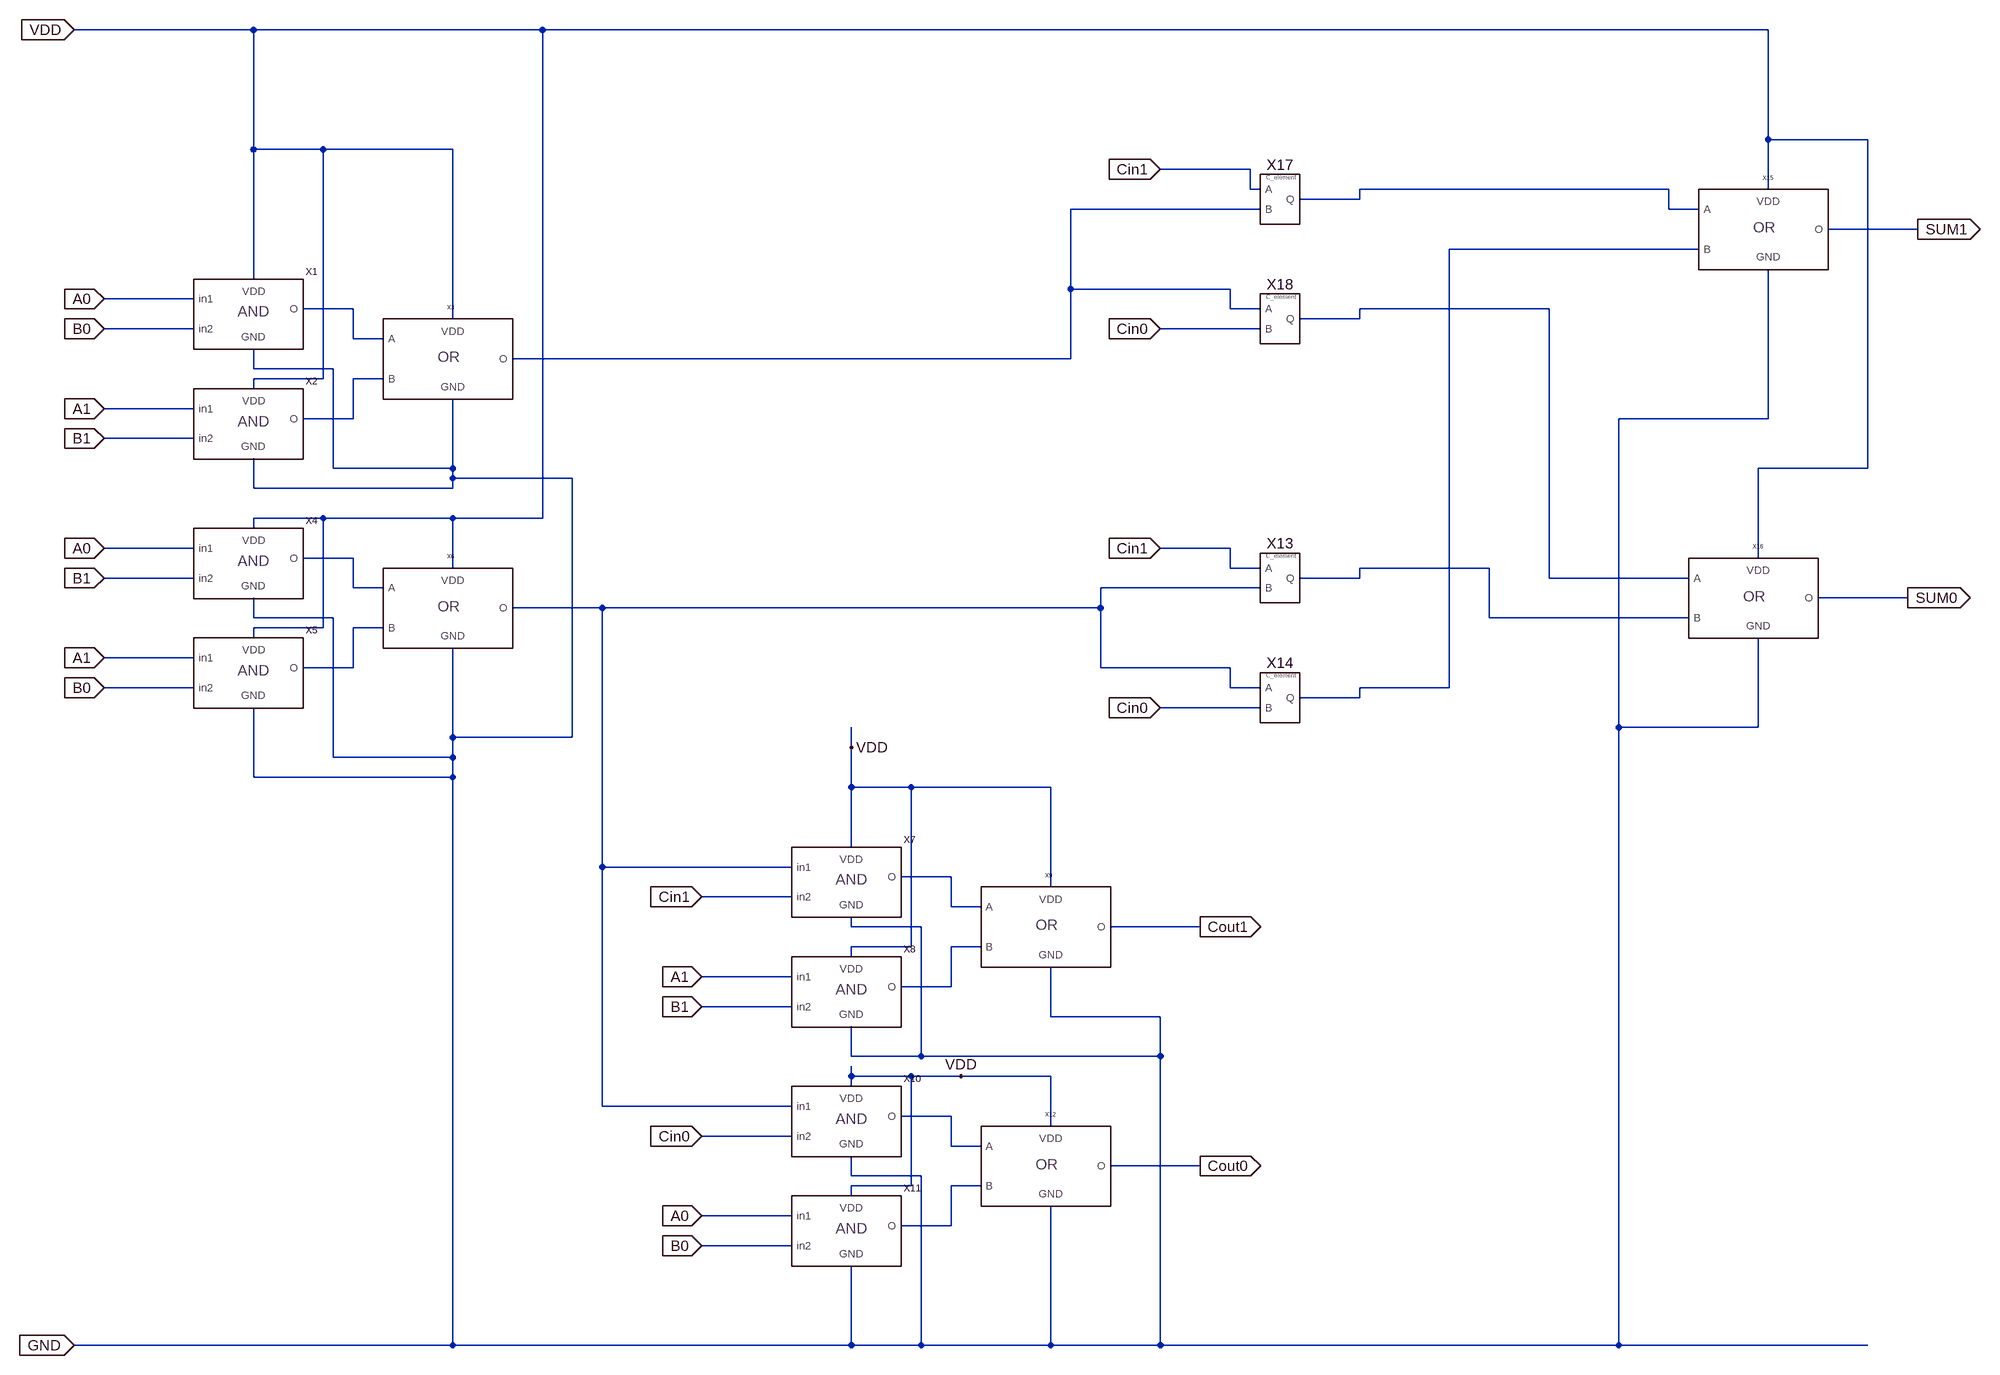
[diagram p0: schematic EFA.asc]
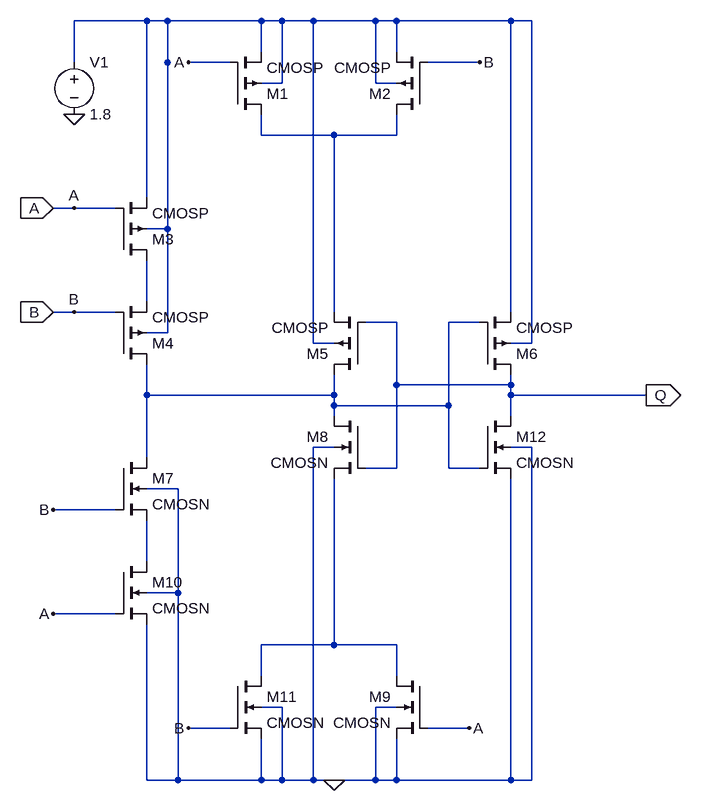
[diagram p1: sub-circuit muller_c_sutherland.asc]
EFA.asc, the LTspice schematic file:
Version 4
SHEET 1 2688 1640
WIRE -112 -544 -400 -544
WIRE 352 -544 -112 -544
WIRE 2320 -544 352 -544
WIRE 2320 -368 2320 -544
WIRE 2480 -368 2320 -368
WIRE -112 -352 -112 -544
WIRE 0 -352 -112 -352
WIRE 208 -352 0 -352
WIRE 1488 -320 1344 -320
WIRE 1488 -288 1488 -320
WIRE 1504 -288 1488 -288
WIRE 2160 -288 1664 -288
WIRE 2320 -288 2320 -368
WIRE 1664 -272 1664 -288
WIRE 1664 -272 1568 -272
WIRE 1504 -256 1200 -256
WIRE 2160 -256 2160 -288
WIRE 2208 -256 2160 -256
WIRE 2560 -224 2416 -224
WIRE 2208 -192 1808 -192
WIRE -112 -144 -112 -352
WIRE 1200 -128 1200 -256
WIRE 1456 -128 1200 -128
WIRE -208 -112 -352 -112
WIRE 48 -96 -32 -96
WIRE 1456 -96 1456 -128
WIRE 1504 -96 1456 -96
WIRE 1968 -96 1664 -96
WIRE 208 -80 208 -352
WIRE 1664 -80 1664 -96
WIRE 1664 -80 1568 -80
WIRE -208 -64 -352 -64
WIRE 1504 -64 1344 -64
WIRE 48 -48 48 -96
WIRE 96 -48 48 -48
WIRE 1200 -16 1200 -128
WIRE 1200 -16 304 -16
WIRE -112 0 -112 -32
WIRE 16 0 -112 0
WIRE 0 16 0 -352
WIRE 0 16 -112 16
WIRE 96 16 48 16
WIRE -112 32 -112 16
WIRE -208 64 -352 64
WIRE 48 80 48 16
WIRE 48 80 -32 80
WIRE 2320 80 2320 -160
WIRE 2320 80 2080 80
WIRE -208 112 -352 112
WIRE 16 160 16 0
WIRE 208 160 208 48
WIRE 208 160 16 160
WIRE 2480 160 2480 -368
WIRE 2480 160 2304 160
WIRE 208 176 208 160
WIRE 400 176 208 176
WIRE -112 192 -112 144
WIRE 208 192 208 176
WIRE 208 192 -112 192
WIRE 0 240 -112 240
WIRE 208 240 0 240
WIRE 352 240 352 -544
WIRE 352 240 208 240
WIRE -112 256 -112 240
WIRE -208 288 -352 288
WIRE 1456 288 1344 288
WIRE 48 304 -32 304
WIRE 2304 304 2304 160
WIRE 208 320 208 240
WIRE 1456 320 1456 288
WIRE 1504 320 1456 320
WIRE 1872 320 1664 320
WIRE -208 336 -352 336
WIRE 1664 336 1664 320
WIRE 1664 336 1568 336
WIRE 1968 336 1968 -96
WIRE 2192 336 1968 336
WIRE 48 352 48 304
WIRE 96 352 48 352
WIRE 1504 352 1248 352
WIRE 2544 368 2400 368
WIRE 448 384 304 384
WIRE 1248 384 1248 352
WIRE 1248 384 448 384
WIRE -112 400 -112 368
WIRE 16 400 -112 400
WIRE 1872 400 1872 320
WIRE 2192 400 1872 400
WIRE 0 416 0 240
WIRE 0 416 -112 416
WIRE 96 416 48 416
WIRE -112 432 -112 416
WIRE -208 464 -352 464
WIRE 48 480 48 416
WIRE 48 480 -32 480
WIRE 1248 480 1248 384
WIRE 1456 480 1248 480
WIRE -208 512 -352 512
WIRE 1456 512 1456 480
WIRE 1504 512 1456 512
WIRE 1808 512 1808 -192
WIRE 1808 512 1664 512
WIRE 1664 528 1664 512
WIRE 1664 528 1568 528
WIRE 1504 544 1344 544
WIRE 2080 576 2080 80
WIRE 2304 576 2304 432
WIRE 2304 576 2080 576
WIRE 208 592 208 448
WIRE 400 592 400 176
WIRE 400 592 208 592
WIRE 848 608 848 576
WIRE 16 624 16 400
WIRE 208 624 208 592
WIRE 208 624 16 624
WIRE -112 656 -112 544
WIRE 208 656 208 624
WIRE 208 656 -112 656
WIRE 848 672 848 608
WIRE 944 672 848 672
WIRE 1168 672 944 672
WIRE 848 768 848 672
WIRE 448 800 448 384
WIRE 752 800 448 800
WIRE 1008 816 928 816
WIRE 1168 832 1168 672
WIRE 752 848 608 848
WIRE 1008 864 1008 816
WIRE 1056 864 1008 864
WIRE 848 896 848 880
WIRE 960 896 848 896
WIRE 1408 896 1264 896
WIRE 944 928 944 672
WIRE 944 928 848 928
WIRE 1056 928 1008 928
WIRE 848 944 848 928
WIRE 752 976 608 976
WIRE 1008 992 1008 928
WIRE 1008 992 928 992
WIRE 752 1024 608 1024
WIRE 1168 1040 1168 960
WIRE 1344 1040 1168 1040
WIRE 848 1104 848 1056
WIRE 960 1104 960 896
WIRE 960 1104 848 1104
WIRE 1344 1104 1344 1040
WIRE 1344 1104 960 1104
WIRE 848 1136 848 1120
WIRE 944 1136 848 1136
WIRE 1024 1136 944 1136
WIRE 1168 1136 1024 1136
WIRE 848 1152 848 1136
WIRE 448 1184 448 800
WIRE 752 1184 448 1184
WIRE 1008 1200 928 1200
WIRE 1168 1216 1168 1136
WIRE 752 1232 608 1232
WIRE 1008 1248 1008 1200
WIRE 1056 1248 1008 1248
WIRE 1408 1280 1264 1280
WIRE 848 1296 848 1264
WIRE 960 1296 848 1296
WIRE 944 1312 944 1136
WIRE 944 1312 848 1312
WIRE 1056 1312 1008 1312
WIRE 848 1328 848 1312
WIRE 752 1360 608 1360
WIRE 1008 1376 1008 1312
WIRE 1008 1376 928 1376
WIRE 752 1408 608 1408
WIRE 208 1568 208 656
WIRE 208 1568 -400 1568
WIRE 848 1568 848 1440
WIRE 848 1568 208 1568
WIRE 960 1568 960 1296
WIRE 960 1568 848 1568
WIRE 1168 1568 1168 1344
WIRE 1168 1568 960 1568
WIRE 1344 1568 1344 1104
WIRE 1344 1568 1168 1568
WIRE 2080 1568 2080 576
WIRE 2080 1568 1344 1568
WIRE 2480 1568 2080 1568
FLAG -352 -112 A0
IOPIN -352 -112 In
FLAG -352 64 A1
IOPIN -352 64 In
FLAG -352 112 B1
IOPIN -352 112 In
FLAG -352 -64 B0
IOPIN -352 -64 In
FLAG -352 288 A0
IOPIN -352 288 In
FLAG -352 464 A1
IOPIN -352 464 In
FLAG -352 512 B0
IOPIN -352 512 In
FLAG -352 336 B1
IOPIN -352 336 In
FLAG 608 976 A1
IOPIN 608 976 In
FLAG 608 1024 B1
IOPIN 608 1024 In
FLAG 608 848 Cin1
IOPIN 608 848 In
FLAG 608 1360 A0
IOPIN 608 1360 In
FLAG 608 1408 B0
IOPIN 608 1408 In
FLAG 608 1232 Cin0
IOPIN 608 1232 In
FLAG 1344 -320 Cin1
IOPIN 1344 -320 In
FLAG 1344 288 Cin1
IOPIN 1344 288 In
FLAG 1344 544 Cin0
IOPIN 1344 544 In
FLAG 1344 -64 Cin0
IOPIN 1344 -64 In
FLAG 2560 -224 SUM1
IOPIN 2560 -224 Out
FLAG 2544 368 SUM0
IOPIN 2544 368 Out
FLAG 1408 896 Cout1
IOPIN 1408 896 Out
FLAG 1408 1280 Cout0
IOPIN 1408 1280 Out
FLAG -400 -544 VDD
IOPIN -400 -544 In
FLAG 848 608 VDD
FLAG 1024 1136 VDD
FLAG -400 1568 GND
IOPIN -400 1568 In
SYMBOL AND -144 -96 R0
SYMATTR InstName X1
SYMBOL AND -144 80 R0
SYMATTR InstName X2
SYMBOL or 192 -16 R0
SYMATTR InstName X3
SYMBOL AND -144 304 R0
SYMATTR InstName X4
SYMBOL AND -144 480 R0
SYMATTR InstName X5
SYMBOL or 192 384 R0
SYMATTR InstName X6
SYMBOL AND 816 816 R0
SYMATTR InstName X7
SYMBOL AND 816 992 R0
SYMATTR InstName X8
SYMBOL or 1152 896 R0
SYMATTR InstName X9
SYMBOL AND 816 1200 R0
SYMATTR InstName X10
SYMBOL AND 816 1376 R0
SYMATTR InstName X11
SYMBOL or 1152 1280 R0
SYMATTR InstName X12
SYMBOL Muller_c_sutherland 1536 336 R0
SYMATTR InstName X13
SYMBOL Muller_c_sutherland 1536 528 R0
SYMATTR InstName X14
SYMBOL or 2304 -224 R0
SYMATTR InstName X15
SYMBOL or 2288 368 R0
SYMATTR InstName X16
SYMBOL Muller_c_sutherland 1536 -272 R0
SYMATTR InstName X17
SYMBOL Muller_c_sutherland 1536 -80 R0
SYMATTR InstName X18

muller_c_sutherland.asc, the sub-circuit schematic file:
Version 4
SHEET 1 880 1236
WIRE -32 -64 -144 -64
WIRE 0 -64 -32 -64
WIRE 144 -64 0 -64
WIRE 176 -64 144 -64
WIRE 224 -64 176 -64
WIRE 320 -64 224 -64
WIRE 352 -64 320 -64
WIRE 528 -64 352 -64
WIRE 560 -64 528 -64
WIRE 144 -16 144 -64
WIRE 352 -16 352 -64
WIRE -144 0 -144 -64
WIRE 96 0 32 0
WIRE 480 0 400 0
WIRE 176 32 176 -64
WIRE 176 32 144 32
WIRE 320 32 320 -64
WIRE 352 32 320 32
WIRE 144 112 144 80
WIRE 256 112 144 112
WIRE 352 112 352 80
WIRE 352 112 256 112
WIRE -32 208 -32 -64
WIRE -144 224 -176 224
WIRE -80 224 -144 224
WIRE 0 256 0 -64
WIRE 0 256 -32 256
WIRE -32 368 -32 304
WIRE -144 384 -176 384
WIRE -80 384 -144 384
WIRE 256 384 256 112
WIRE 528 384 528 -64
WIRE 352 400 304 400
WIRE 480 400 432 400
WIRE 0 416 0 256
WIRE 0 416 -32 416
WIRE 224 432 224 -64
WIRE 256 432 224 432
WIRE 560 432 560 -64
WIRE 560 432 528 432
WIRE 352 496 352 400
WIRE 528 496 528 480
WIRE 528 496 352 496
WIRE -32 512 -32 464
WIRE 256 512 256 480
WIRE 256 512 -32 512
WIRE 528 512 528 496
WIRE 736 512 528 512
WIRE 256 528 256 512
WIRE 432 528 432 400
WIRE 432 528 256 528
WIRE 256 544 256 528
WIRE 528 544 528 512
WIRE 256 592 224 592
WIRE 560 592 528 592
WIRE -32 608 -32 512
WIRE 352 624 352 496
WIRE 352 624 304 624
WIRE 432 624 432 528
WIRE 480 624 432 624
WIRE 16 656 -32 656
WIRE -80 688 -176 688
WIRE -32 768 -32 704
WIRE 16 816 16 656
WIRE 16 816 -32 816
WIRE -80 848 -176 848
WIRE 256 896 256 640
WIRE 256 896 144 896
WIRE 352 896 256 896
WIRE 144 944 144 896
WIRE 352 944 352 896
WIRE 176 992 144 992
WIRE 352 992 320 992
WIRE 96 1024 32 1024
WIRE 464 1024 400 1024
WIRE -32 1104 -32 864
WIRE 16 1104 16 816
WIRE 16 1104 -32 1104
WIRE 144 1104 144 1040
WIRE 144 1104 16 1104
WIRE 176 1104 176 992
WIRE 176 1104 144 1104
WIRE 224 1104 224 592
WIRE 224 1104 176 1104
WIRE 256 1104 224 1104
WIRE 320 1104 320 992
WIRE 320 1104 256 1104
WIRE 352 1104 352 1040
WIRE 352 1104 320 1104
WIRE 528 1104 528 640
WIRE 528 1104 352 1104
WIRE 560 1104 560 592
WIRE 560 1104 528 1104
WIRE 0 0 0 0
FLAG 736 512 Q
IOPIN 736 512 Out
FLAG -176 224 A
IOPIN -176 224 In
FLAG -176 384 B
IOPIN -176 384 In
FLAG 32 0 A
FLAG 480 0 B
FLAG -176 688 B
FLAG -176 848 A
FLAG 32 1024 B
FLAG 464 1024 A
FLAG 256 1104 0
FLAG -144 80 0
FLAG -144 224 A
FLAG -144 384 B
SYMBOL pmos4 96 80 M180
SYMATTR InstName M1
SYMATTR Value CMOSP
SYMATTR Value2 l=180n w=440n
SYMBOL pmos4 400 80 R180
SYMATTR InstName M2
SYMATTR Value CMOSP
SYMATTR Value2 l=180n w=440n
SYMBOL pmos4 -80 304 M180
SYMATTR InstName M3
SYMATTR Value CMOSP
SYMATTR Value2 l=180n w=440n
SYMBOL pmos4 -80 464 M180
SYMATTR InstName M4
SYMATTR Value CMOSP
SYMATTR Value2 l=180n w=440n
SYMBOL pmos4 304 480 R180
SYMATTR InstName M5
SYMATTR Value CMOSP
SYMATTR Value2 l=180n w=440n
SYMBOL pmos4 480 480 M180
SYMATTR InstName M6
SYMATTR Value CMOSP
SYMATTR Value2 l=180n w=440n
SYMBOL nmos4 -80 608 R0
SYMATTR InstName M7
SYMATTR Value CMOSN
SYMATTR Value2 l=180n w=220n
SYMBOL nmos4 304 544 M0
SYMATTR InstName M8
SYMATTR Value CMOSN
SYMATTR Value2 l=180n w=220n
SYMBOL nmos4 400 944 M0
SYMATTR InstName M9
SYMATTR Value CMOSN
SYMATTR Value2 l=180n w=220n
SYMBOL nmos4 -80 768 R0
SYMATTR InstName M10
SYMATTR Value CMOSN
SYMATTR Value2 l=180n w=220n
SYMBOL nmos4 96 944 R0
SYMATTR InstName M11
SYMATTR Value CMOSN
SYMATTR Value2 l=180n w=220n
SYMBOL nmos4 480 544 R0
SYMATTR InstName M12
SYMATTR Value CMOSN
SYMATTR Value2 l=180n w=220n
SYMBOL voltage -144 -16 R0
WINDOW 123 0 0 Left 0
WINDOW 39 0 0 Left 0
SYMATTR InstName V1
SYMATTR Value 1.8

The netlist it stands for:
* EFA.asc
XX1 A0 B0 VDD GND N004 AND  ; pins in1 in2 VDD GND O
XX2 A1 B1 VDD GND N006 AND  ; pins in1 in2 VDD GND O
XX3 N004 N006 VDD GND N002 or  ; pins A B VDD GND O
XX4 A0 B1 VDD GND N007 AND  ; pins in1 in2 VDD GND O
XX5 A1 B0 VDD GND N010 AND  ; pins in1 in2 VDD GND O
XX6 N007 N010 VDD GND N009 or  ; pins A B VDD GND O
XX7 N009 Cin1 VDD GND N011 AND  ; pins in1 in2 VDD GND O
XX8 A1 B1 VDD GND N012 AND  ; pins in1 in2 VDD GND O
XX9 N011 N012 VDD GND Cout1 or  ; pins A B VDD GND O
XX10 N009 Cin0 VDD GND N013 AND  ; pins in1 in2 VDD GND O
XX11 A0 B0 VDD GND N014 AND  ; pins in1 in2 VDD GND O
XX12 N013 N014 VDD GND Cout0 or  ; pins A B VDD GND O
XX13 Cin1 N009 N008 muller_c_sutherland
XX14 N009 Cin0 N003 muller_c_sutherland
XX15 N001 N003 VDD GND SUM1 or  ; pins A B VDD GND O
XX16 N005 N008 VDD GND SUM0 or  ; pins A B VDD GND O
XX17 Cin1 N002 N001 muller_c_sutherland
XX18 N002 Cin0 N005 muller_c_sutherland

* block symbol definitions
.subckt muller_c_sutherland A B Q
M1 N002 A N001 N001 CMOSP l=180n w=440n
M2 N002 B N001 N001 CMOSP l=180n w=440n
M3 N003 A N001 N001 CMOSP l=180n w=440n
M4 N004 B N003 N001 CMOSP l=180n w=440n
M5 N004 Q N002 N001 CMOSP l=180n w=440n
M6 Q N004 N001 N001 CMOSP l=180n w=440n
M7 N004 B N005 0 CMOSN l=180n w=220n
M8 N004 Q N006 0 CMOSN l=180n w=220n
M9 N006 A 0 0 CMOSN l=180n w=220n
M10 N005 A 0 0 CMOSN l=180n w=220n
M11 N006 B 0 0 CMOSN l=180n w=220n
M12 Q N004 0 0 CMOSN l=180n w=220n
V1 N001 0 1.8
.ends muller_c_sutherland

.model NMOS NMOS
.model PMOS PMOS
.lib standard.mos
.backanno
.end